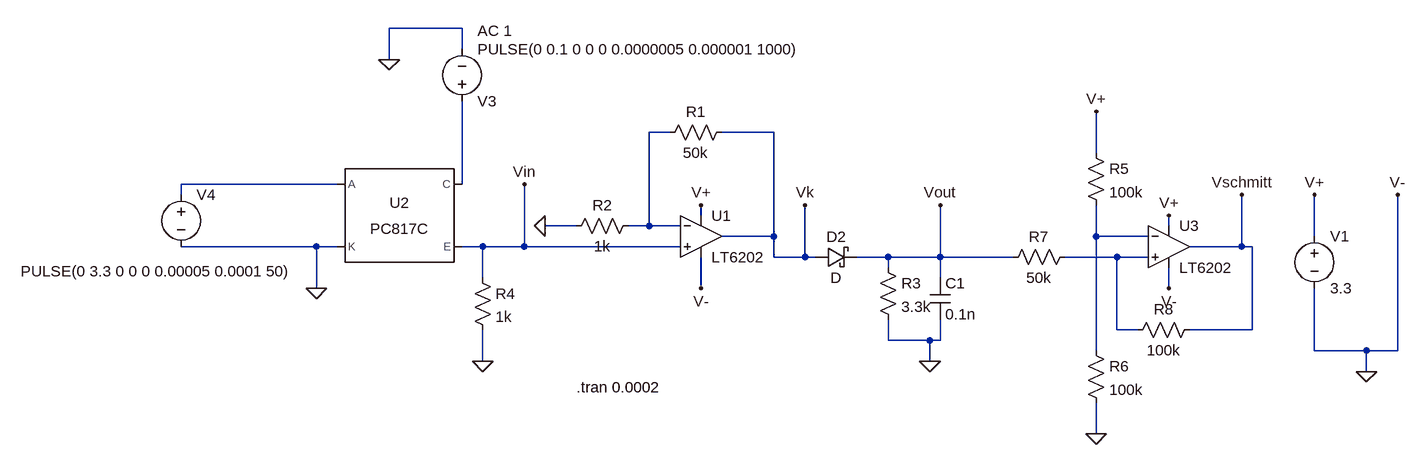
[diagram p0: schematic LiFi transmission + schmitt trigger.asc]
LiFi transmission + schmitt trigger.asc, the LTspice schematic file:
Version 4
SHEET 1 1600 680
WIRE 80 -176 -32 -176
WIRE 80 -144 80 -176
WIRE -32 -128 -32 -176
WIRE 400 -16 368 -16
WIRE 560 -16 480 -16
WIRE 1056 16 1056 -48
WIRE -112 64 -352 64
WIRE 80 64 80 -64
WIRE -352 80 -352 64
WIRE 448 112 448 96
WIRE 256 128 208 128
WIRE 368 128 368 -16
WIRE 368 128 336 128
WIRE 416 128 368 128
WIRE 1168 128 1168 112
WIRE 560 144 560 -16
WIRE 560 144 480 144
WIRE 1056 144 1056 96
WIRE 1136 144 1056 144
WIRE 1392 144 1392 80
WIRE -144 160 -352 160
WIRE -112 160 -144 160
WIRE 112 160 80 160
WIRE 176 160 176 64
WIRE 176 160 112 160
WIRE 416 160 176 160
WIRE 1280 160 1280 80
WIRE 1280 160 1200 160
WIRE 1296 160 1280 160
WIRE 560 176 560 144
WIRE 608 176 608 96
WIRE 608 176 560 176
WIRE 624 176 608 176
WIRE 736 176 688 176
WIRE 816 176 816 96
WIRE 816 176 736 176
WIRE 928 176 816 176
WIRE 1088 176 1008 176
WIRE 1136 176 1088 176
WIRE 736 192 736 176
WIRE 112 208 112 160
WIRE 816 208 816 176
WIRE -144 224 -144 160
WIRE 448 224 448 176
WIRE 1168 224 1168 192
WIRE 1088 288 1088 176
WIRE 1120 288 1088 288
WIRE 1296 288 1296 160
WIRE 1296 288 1200 288
WIRE 736 304 736 272
WIRE 800 304 736 304
WIRE 816 304 816 272
WIRE 816 304 800 304
WIRE 1056 320 1056 144
WIRE 1392 320 1392 224
WIRE 1472 320 1392 320
WIRE 1520 320 1520 80
WIRE 1520 320 1472 320
WIRE 112 336 112 288
WIRE 800 336 800 304
WIRE 1472 352 1472 320
WIRE 1056 448 1056 400
FLAG 1472 352 0
FLAG 1392 80 V+
FLAG 448 96 V+
FLAG 448 224 V-
FLAG 1520 80 V-
FLAG 208 128 0
FLAG 800 336 0
FLAG 176 64 Vin
FLAG 608 96 Vk
FLAG 816 96 Vout
FLAG -32 -128 0
FLAG -144 224 0
FLAG 112 336 0
FLAG 1168 112 V+
FLAG 1168 224 V-
FLAG 1056 448 0
FLAG 1056 -48 V+
FLAG 1280 80 Vschmitt
SYMBOL voltage 1392 128 R0
WINDOW 123 0 0 Left 2
WINDOW 39 0 0 Left 2
SYMATTR InstName V1
SYMATTR Value 3.3
SYMBOL voltage 80 -48 M180
WINDOW 123 24 124 Left 2
WINDOW 39 0 0 Left 2
SYMATTR Value2 AC 1
SYMATTR InstName V3
SYMATTR Value PULSE(0 0.1 0 0 0 0.0000005 0.000001 1000)
SYMBOL Opamps\\LT6202 448 144 R0
SYMATTR InstName U1
SYMBOL res 496 -32 R90
WINDOW 0 0 56 VBottom 2
WINDOW 3 32 56 VTop 2
SYMATTR InstName R1
SYMATTR Value 50k
SYMBOL res 352 112 R90
WINDOW 0 0 56 VBottom 2
WINDOW 3 32 56 VTop 2
SYMATTR InstName R2
SYMATTR Value 1k
SYMBOL res 720 176 R0
SYMATTR InstName R3
SYMATTR Value 3.3k
SYMBOL cap 800 208 R0
SYMATTR InstName C1
SYMATTR Value 0.1n
SYMBOL voltage -352 64 R0
WINDOW 123 0 0 Left 2
WINDOW 39 0 0 Left 2
WINDOW 3 -247 134 Left 2
SYMATTR Value PULSE(0 3.3 0 0 0 0.00005 0.0001 50)
SYMATTR InstName V4
SYMBOL schottky 624 192 R270
WINDOW 0 32 32 VTop 2
WINDOW 3 0 32 VBottom 2
SYMATTR InstName D2
SYMBOL Optos\\PC817C -16 112 R0
SYMATTR InstName U2
SYMBOL res 96 192 R0
SYMATTR InstName R4
SYMATTR Value 1k
SYMBOL Opamps\\LT6202 1168 160 R0
SYMATTR InstName U3
SYMBOL res 1040 0 R0
SYMATTR InstName R5
SYMATTR Value 100k
SYMBOL res 1040 304 R0
SYMATTR InstName R6
SYMATTR Value 100k
SYMBOL res 1024 160 R90
WINDOW 0 0 56 VBottom 2
WINDOW 3 32 56 VTop 2
SYMATTR InstName R7
SYMATTR Value 50k
SYMBOL res 1216 272 R90
WINDOW 0 0 56 VBottom 2
WINDOW 3 32 56 VTop 2
SYMATTR InstName R8
SYMATTR Value 100k
TEXT 256 376 Left 2 !.tran 0.0002

The netlist it stands for:
* LiFi transmission + schmitt trigger.asc
V1 V+ 0 3.3
V3 N003 0 PULSE(0 0.1 0 0 0 0.0000005 0.000001 1000) AC 1
* U1: LT6202 (symbol Opamps\LT6202 not available, pins judged from their places): In+=Vin In-=N001 V+=V+ V-=0 OUT=Vk
R1 Vk N001 50k
R2 N001 0 1k
R3 Vout 0 3.3k
C1 Vout 0 0.1n
V4 N002 0 PULSE(0 3.3 0 0 0 0.00005 0.0001 50)
D2 Vk Vout D
XU2 N002 0 N003 Vin PC817 Igain=2.3m  ; PC817C, pins A K C E
R4 Vin 0 1k
* U3: LT6202 (symbol Opamps\LT6202 not available, pins judged from their places): In+=N005 In-=N004 V+=V+ V-=0 OUT=Vschmitt
R5 V+ N004 100k
R6 N004 0 100k
R7 N005 Vout 50k
R8 Vschmitt N005 100k
.model D D
.lib standard.dio
.tran 0.0002
.lib PC817.sub
.backanno
.end